# EAGLE design DoDecaCharlieCylon (EAGLE 6.5.0)
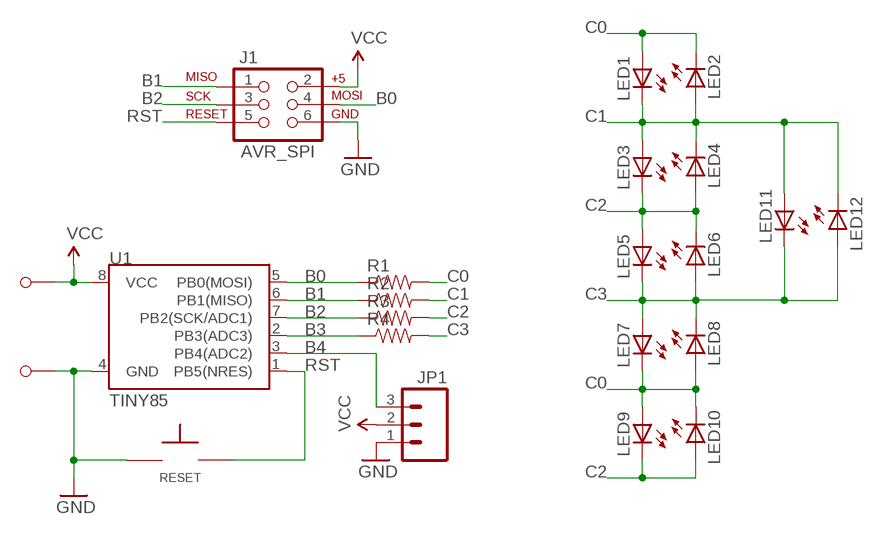
[diagram p0: schematic, sheet 1]

## Parts
J1  AVR_SPI  AVR_SPI_PRG_6LABELED  [2X3-NS]
JP1  M03PTH  [1X03]
LED1  LEDOVAL  [LED-OVAL]
LED2  LEDOVAL  [LED-OVAL]
LED3  LEDOVAL  [LED-OVAL]
LED4  LEDOVAL  [LED-OVAL]
LED5  LEDOVAL  [LED-OVAL]
LED6  LEDOVAL  [LED-OVAL]
LED7  LEDOVAL  [LED-OVAL]
LED8  LEDOVAL  [LED-OVAL]
LED9  LEDOVAL  [LED-OVAL]
LED10  LEDOVAL  [LED-OVAL]
LED11  LEDOVAL  [LED-OVAL]
LED12  LEDOVAL  [LED-OVAL]
R1  RESISTORAXIAL-0.3  [AXIAL-0.3]
R2  RESISTORAXIAL-0.3  [AXIAL-0.3]
R3  RESISTORAXIAL-0.3  [AXIAL-0.3]
R4  RESISTORAXIAL-0.3  [AXIAL-0.3]
RESET  TAC_SPST_NO  [TAC_SPST_NO]
U1  TINY85  ATTINY45TINY85-20-DIP  [DIP08]
U$1  M1  [M1_NO_STRAIN]
U$2  M1  [M1_NO_STRAIN]

## Nets
B0: J1.4(MOSI) R1.P$1 U1.5(PB0(MOSI))
B1: J1.1(MISO) R2.P$1 U1.6(PB1(MISO))
B2: J1.3(SCK) R3.P$1 U1.7(PB2(SCK/ADC1))
B3: R4.P$1 U1.2(PB3(ADC3))
B4: JP1.3 U1.3(PB4(ADC2))
C0: LED1.ANODE(A) LED2.CATHODE(C) LED7.CATHODE(C) LED8.ANODE(A) LED9.ANODE(A) LED10.CATHODE(C) R1.P$2
C1: LED1.CATHODE(C) LED2.ANODE(A) LED3.ANODE(A) LED4.CATHODE(C) LED11.ANODE(A) LED12.CATHODE(C) R2.P$2
C2: LED3.CATHODE(C) LED4.ANODE(A) LED5.ANODE(A) LED6.CATHODE(C) LED9.CATHODE(C) LED10.ANODE(A) R3.P$2
C3: LED5.CATHODE(C) LED6.ANODE(A) LED7.ANODE(A) LED8.CATHODE(C) LED11.CATHODE(C) LED12.ANODE(A) R4.P$2
GND: J1.6(GND) JP1.1 RESET.P$1 U1.4(GND) U$2.P$1
RST: J1.5(RST) RESET.P$2 U1.1(PB5(NRES))
VCC: J1.2(V+) JP1.2 U1.8(VCC) U$1.P$1

## Library data of the parts
J1 = barbary_enterprises:AVR_SPI_PRG_6: AVR ISP 6 Pin This is the reduced ISP connector for AVR programming. Common on Arduino. This footprint will take up less PCB space and can be used with a 10-pin to 6-pin adapter such as SKU: BOB-08508
JP1 = SparkFun-Connectors:M03: Header 3 Standard 3-pin 0.1" header. Use with straight break away headers (SKU : PRT-00116), right angle break away headers (PRT-00553), swiss pins (PRT-00743), machine pins (PRT-00117), and female headers (PRT-00115). Molex polarized connector foot print use with SKU : PRT-08232 with associated crimp pins and housings.
LED1-LED12 = barbary_enterprises:LED: LEDs Standard schematic elements and footprints for 5mm, 3mm, 1206, and 0603 sized LEDs. 5mm - Spark Fun Electronics SKU : COM-00529 (and others)
R1-R4 = barbary_enterprises:RESISTOR: Resistor Basic schematic elements and footprints for 0603, 1206, and PTH resistors.
RESET = barbary_enterprises:TAC_SPST_NO: 3,5 mm Tact Switches C&K PTS635 Series * Digi-Key Part Number: CKN9102-ND
U1 = SparkFun-DigitalIC:ATTINY45: Atmel 8-pin 2/4/8kB flash uC; PROD_ID: IC-09445; VALUE: TINY85-20-DIP
U$1 U$2 = barbary_enterprises:M1

## Board
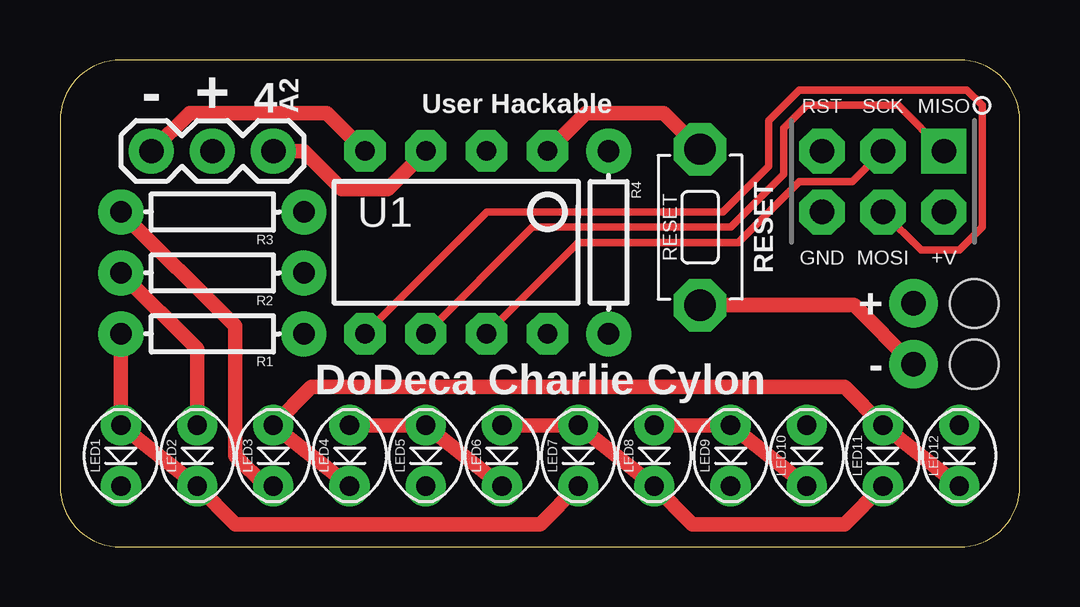
[diagram p1: board, top side]
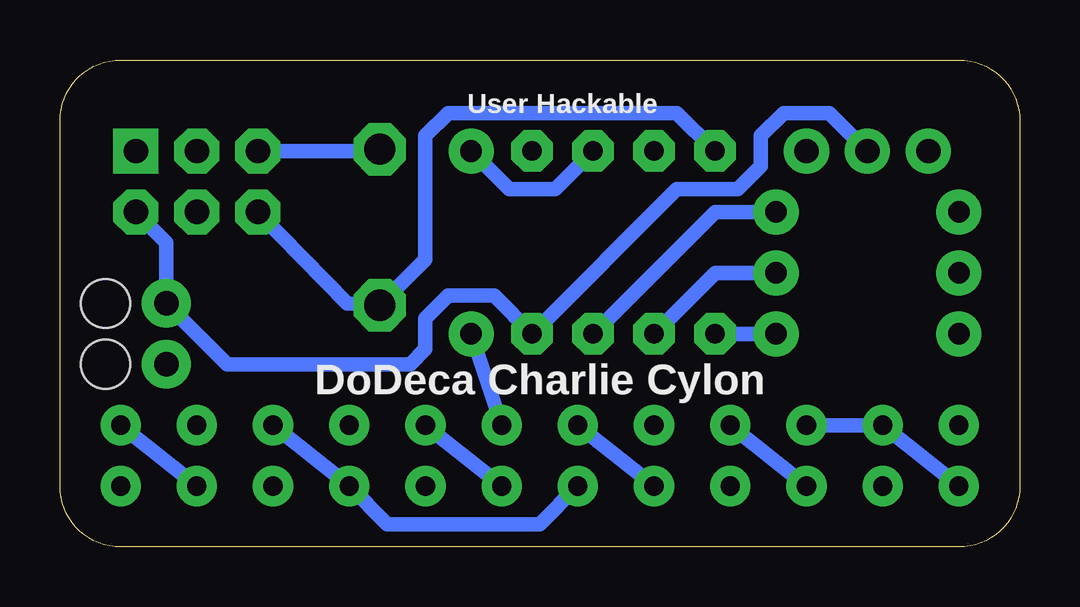
[diagram p2: board, bottom side, seen from below]

Size 39.99 x 20.31 mm. Coordinates in mm from the lower left corner, seen from the top.
Outline: 39.99,2.53 39.99,17.78 arc90 37.47,20.31 2.54,20.31 arc90 0,17.77 0,2.54 arc90 2.54,0 37.47,0 arc90 39.99,2.53
Copper layers (1*16): Top 0.0356mm / dielectric 1.5011mm / Bottom 0.0356mm
Design rules "LaenPCBOrder": minimum track width 6mil, minimum drill 13mil, track to track 6mil, track to pad 6mil, pad to pad 6mil, via to via 6mil, smd to smd 6mil, copper to edge 15mil, drill to drill 6mil, minimum pad ring 7mil, minimum via ring 7mil, stop-mask expansion 3mil, vias tented up to drill 0mil, thermal gap 10mil

### Footprints (pad centres in the part's own frame; a part is rotated, then mirrored left to right if it is on the bottom)
2X3-NS = drill 1.016 pad 1.88 square: 1 -2.54,-1.27 | drill 1.016 pad 1.88 octagon: 2 -2.54,1.27; 3 0,-1.27; 4 0,1.27; 5 2.54,-1.27; 6 2.54,1.27
1X03 = drill 1.016 pad 1.88: 1 0,0; 2 2.54,0; 3 5.08,0
LED-OVAL = drill 0.8 pad 1.676: ANODE 1.27,0; CATHODE -1.27,0
AXIAL-0.3 = drill 0.9 pad 1.88: P$1 -3.81,0; P$2 3.81,0
TAC_SPST_NO = drill 1.3 pad 2.184 octagon: P$1 -3.251,0; P$2 3.251,0
DIP08 = drill 0.813 pad 1.727 octagon: 1 -3.81,-3.81; 2 -1.27,-3.81; 3 1.27,-3.81; 4 3.81,-3.81; 5 3.81,3.81; 6 1.27,3.81; 7 -1.27,3.81; 8 -3.81,3.81
M1_NO_STRAIN = drill 1.016 pad 2.032: P$1 0,0 | hole 2.032: 2.54,0

### Placement (x,y rotation side)
J1  34.29,15.24 180 top
JP1  3.81,16.51 0 top
LED1  2.54,3.81 90 top
LED2  5.71,3.81 90 top
LED3  8.89,3.81 90 top
LED4  12.06,3.81 90 top
LED5  15.24,3.81 90 top
LED6  18.41,3.81 90 top
LED7  21.59,3.81 90 top
LED8  24.77,3.81 90 top
LED9  27.94,3.81 90 top
LED10  31.11,3.81 90 top
LED11  34.29,3.81 90 top
LED12  37.47,3.81 90 top
R1  6.35,8.89 180 top
R2  6.35,11.43 180 top
R3  6.35,13.97 180 top
R4  22.86,12.7 270 top
RESET  26.67,13.34 90 top
U1  16.51,12.7 180 top
U$1  35.56,10.16 0 top
U$2  35.56,7.62 0 top

### Tracks (layer width: path | path; a pad name or v marks a point on that pad's centre or on a via)
B0
  Top 0.305: U1.5 17.78,13.97 27.62,13.97 29.53,15.88 29.53,17.78 30.8,19.05 37.78,19.05 38.42,18.41 38.42,13.34 37.47,12.38 35.88,12.38 J1.4
  Bottom 0.61: U1.5 R1.P$1
B1
  Top 0.305: U1.6 19.68,13.34 27.94,13.34 30.16,15.56 30.16,17.46 31.11,18.41 34.92,18.41 J1.1
  Bottom 0.61: R2.P$1 12.7,11.43 U1.6
B2
  Top 0.305: U1.7 21.59,12.7 28.26,12.7 30.8,15.24 33.02,15.24 J1.3
  Bottom 0.61: R3.P$1 12.7,13.97 U1.7
B3
  Bottom 0.61: U1.2 19.37,14.92 21.27,14.92 R4.P$1
B4
  Top 0.61: U1.3 13.65,14.92 11.75,14.92 10.16,16.51 JP1.3
C0
  Top 0.61: R1.P$2 LED1.ANODE LED2.CATHODE 7.3,0.95 20,0.95 LED7.CATHODE | LED8.ANODE LED9.ANODE LED10.CATHODE
  Bottom 0.61: LED7.CATHODE LED8.ANODE
C1
  Top 0.61: LED4.CATHODE LED3.ANODE 10.48,6.67 32.7,6.67 LED11.ANODE LED12.CATHODE | LED2.ANODE 5.71,8.26 R2.P$2
  Bottom 0.61: LED3.ANODE LED2.ANODE LED1.CATHODE
C2
  Top 0.61: LED4.ANODE LED5.ANODE LED6.CATHODE | LED3.CATHODE 8.57,2.54 7.3,3.81 7.3,9.21 R3.P$2
  Bottom 0.61: LED3.CATHODE LED4.ANODE | LED10.ANODE LED9.CATHODE 26.35,0.95 20,0.95 LED6.CATHODE
C3
  Top 0.61: LED6.ANODE LED7.ANODE LED8.CATHODE 26.35,0.95 32.7,0.95 LED11.CATHODE
  Bottom 0.61: LED7.ANODE R4.P$2 | LED5.CATHODE LED6.ANODE | LED11.CATHODE LED12.ANODE
GND
  Top 0.61: U1.4 11.11,18.1 5.4,18.1 JP1.1 | U$2.P$1 33.1,10.08 RESET.P$1
  Bottom 0.61: U1.4 14.29,18.1 23.81,18.1 24.77,17.14 24.77,11.99 RESET.P$1 28.02,10.16 J1.6
RST
  Top 0.61: RESET.P$2 25.16,18.1 21.91,18.1 U1.1
  Bottom 0.61: RESET.P$2 26.99,16.51 J1.5
VCC
  Bottom 0.61: JP1.2 7.94,18.1 9.84,18.1 10.79,17.14 10.79,15.88 11.75,14.92 14.29,14.92 U1.8 21.91,10.48 23.81,10.48 24.77,9.53 24.77,8.26 25.4,7.62 33.02,7.62 U$1.P$1 35.56,12.7 J1.2

### Text on the board
tPlace: - | + | 4 | A2 | User Hackable | RESET | + | - | DoDeca Charlie Cylon
bPlace: User Hackable | DoDeca Charlie Cylon